# Altium schematic sheet Charger.SchDoc: Chargeur cellules lithium
size Legal; DocumentNumber: 6; SheetNumber: 6; SheetTotal: 8; Version: Gamma 1.0; Conceptor: Philippe Turgeon
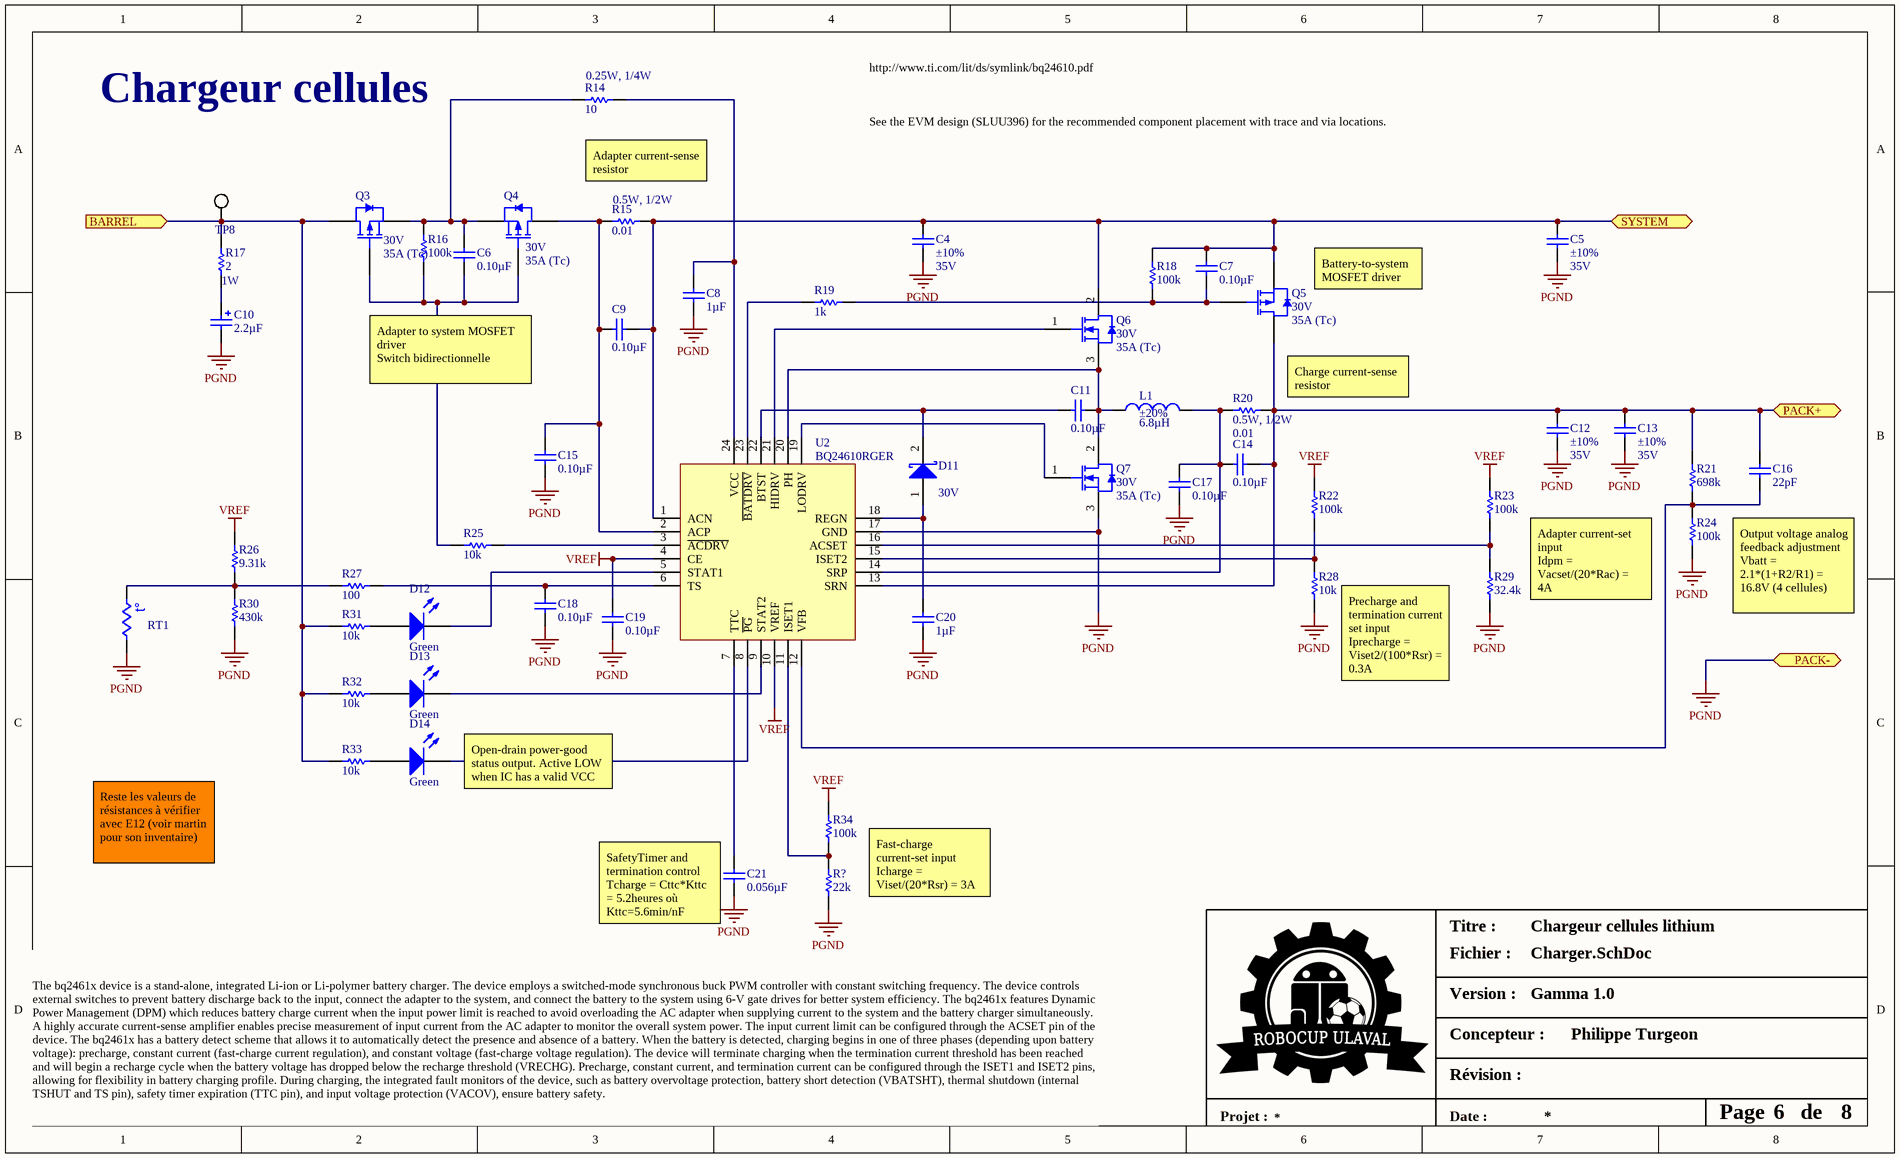
[diagram p0: Charger.SchDoc]

## Parts
C4  Tolerance: ±10%  Voltage - Rated: 35V  [1206]  (hidden comment: GMK316AB7106KL-TR)
C5  Tolerance: ±10%  Voltage - Rated: 35V  [1206]  (hidden comment: GMK316AB7106KL-TR)
C6  Capacitance: 0.10µF  [0603]  (hidden comment: CL10B104KB8SFNC)
C7  Capacitance: 0.10µF  [0603]  (hidden comment: CL10B104KB8SFNC)
C8  Capacitance: 1µF  [0805]  (hidden comment: CL21B105KBFNFNE)
C9  Capacitance: 0.10µF  [0603]  (hidden comment: CL10B104KB8SFNC)
C10  Capacitance: 2.2µF  [CAP 4.3x4.3mm]  (hidden comment: 865060640002)
C11  Capacitance: 0.10µF  [0603]  (hidden comment: CL10B104KB8SFNC)
C12  Tolerance: ±10%  Voltage - Rated: 35V  [1206]  (hidden comment: GMK316AB7106KL-TR)
C13  Tolerance: ±10%  Voltage - Rated: 35V  [1206]  (hidden comment: GMK316AB7106KL-TR)
C14  Capacitance: 0.10µF  [0603]  (hidden comment: CL10B104KB8SFNC)
C15  Capacitance: 0.10µF  [0603]  (hidden comment: CL10B104KB8SFNC)
C16  Capacitance: 22pF  [0603]  (hidden comment: CL10C220GB8NNNC)
C17  Capacitance: 0.10µF  [0603]  (hidden comment: CL10B104KB8SFNC)
C18  Capacitance: 0.10µF  [0603]  (hidden comment: CL10B104KB8SFNC)
C19  Capacitance: 0.10µF  [0603]  (hidden comment: CL10B104KB8SFNC)
C20  Capacitance: 1µF  [0805]  (hidden comment: CL21B105KBFNFNE)
C21  Capacitance: 0.056µF  [0603]  (hidden comment: CL10B563KB8NNNC)
D11  Voltage - DC Reverse (Vr) (Max): 30V  [SOT-23-3]  (hidden comment: BAT54SLT1G)
D12  Color: Green  [0805]  (hidden comment: LG R971-KN-1)
D13  Color: Green  [0805]  (hidden comment: LG R971-KN-1)
D14  Color: Green  [0805]  (hidden comment: LG R971-KN-1)
L1  Inductance: 6.8µH  Tolerance: ±20%  [INDM6965X30N]  (hidden comment: IHLP2525CZER6R8M11)
Q3  Drain to Source Voltage (Vdss): 30V  Current - Continuous Drain (Id) @ 25°C: 35A (Tc)  [PowerPAK 1212-8]  (hidden comment: SI7617DN-T1-GE3)
Q4  Drain to Source Voltage (Vdss): 30V  Current - Continuous Drain (Id) @ 25°C: 35A (Tc)  [PowerPAK 1212-8]  (hidden comment: SI7617DN-T1-GE3)
Q5  Drain to Source Voltage (Vdss): 30V  Current - Continuous Drain (Id) @ 25°C: 35A (Tc)  [PowerPAK 1212-8]  (hidden comment: SI7617DN-T1-GE3)
Q6  Drain to Source Voltage (Vdss): 30V  Current - Continuous Drain (Id) @ 25°C: 35A (Tc)  [PowerPAK 1212-8]  (hidden comment: SI7114ADN-T1-GE3)
Q7  Drain to Source Voltage (Vdss): 30V  Current - Continuous Drain (Id) @ 25°C: 35A (Tc)  [PowerPAK 1212-8]  (hidden comment: SI7114ADN-T1-GE3)
R14  Power (Watts): 0.25W, 1/4W  Resistance (Ohms): 10  (hidden comment: ESR03EZPJ100)
R15  Power (Watts): 0.5W, 1/2W  Resistance (Ohms): 0.01  [1206]  (hidden comment: RU3216FR010CS)
R16  Resistance (Ohms): 100k  [0603]  (hidden comment: RC0603JR-07100KL)
R17  Power (Watts): 1W  Resistance (Ohms): 2  [2512]  (hidden comment: CRCW25122R00JNEG)
R18  Resistance (Ohms): 100k  [0603]  (hidden comment: RC0603JR-07100KL)
R19  Resistance (Ohms): 1k  [0603]  (hidden comment: RC0603JR-071KL)
R20  Power (Watts): 0.5W, 1/2W  Resistance (Ohms): 0.01  [1206]  (hidden comment: RU3216FR010CS)
R21  Resistance (Ohms): 698k  [0603]  (hidden comment: RC0603FR-07698KL)
R22  Resistance (Ohms): 100k  [0603]  (hidden comment: RC0603JR-07100KL)
R23  Resistance (Ohms): 100k  [0603]  (hidden comment: RC0603JR-07100KL)
R24  Resistance (Ohms): 100k  [0603]  (hidden comment: RC0603JR-07100KL)
R25  Resistance (Ohms): 10k  [0603]  (hidden comment: RC0603JR-0710KL)
R26  Resistance (Ohms): 9.31k  [0603]  (hidden comment: RC0603FR-079K31L)
R27  Resistance (Ohms): 100  [0603]  (hidden comment: RC0603FR-07100RL)
R28  Resistance (Ohms): 10k  [0603]  (hidden comment: RC0603JR-0710KL)
R29  Resistance (Ohms): 32.4k  [0603]  (hidden comment: RC0603FR-0732K4L)
R30  Resistance (Ohms): 430k  [0603]  (hidden comment: RC0603FR-07430KL)
R31  Resistance (Ohms): 10k  [0603]  (hidden comment: RC0603JR-0710KL)
R32  Resistance (Ohms): 10k  [0603]  (hidden comment: RC0603JR-0710KL)
R33  Resistance (Ohms): 10k  [0603]  (hidden comment: RC0603JR-0710KL)
R34  Resistance (Ohms): 100k  [0603]  (hidden comment: RC0603JR-07100KL)
R?  Resistance (Ohms): 22k  [0603]  (hidden comment: RC0603FR-0722KL)
RT1  NTCLE100E3103HT1  [NTCLE100E3]  (value not drawn)
TP8  testpoint  [0805 testpoint]  (value not drawn)
U2  BQ24610RGER  [VQFN-24]

## Ports
BARREL (in), PACK+, PACK-, SYSTEM

## Nets
PGND: C4.1 C5.1 C8.1 C10.2 C12.1 C13.1 C15.1 C17.1 C18.1 C19.1 C20.1 C21.1 Q7.3(S) R24.1 R28.1 R29.1 R30.1 R?.1 RT1.2 U2.17(GND) ; port PACK-
VREF: C19.2 R22.2 R23.2 R26.2 R34.2 U2.4(CE) U2.10(VREF)
BARREL: Q3.2(D) R17.2 R31.1 R32.1 R33.1 TP8.1 ; port BARREL
PACK+: C12.2 C13.2 C14.1 C16.2 Q5.2(D) R20.1 R21.2 U2.13(SRN) ; port PACK+
SYSTEM: C4.2 C5.2 C7.2 C9.1 Q5.3(S) Q6.2(D) R15.2 R18.2 U2.1(ACN) ; port SYSTEM
NetC6_1: C6.1 Q3.1(G) Q4.1(G) R16.1 R25.1
NetC6_2: C6.2 Q3.3(S) Q4.3(S) R14.1 R16.2
NetC7_1: C7.1 Q5.1(G) R18.1 R19.2
NetC8_2: C8.2 R14.2 U2.24(VCC)
NetC9_2: C9.2 C15.2 Q4.2(D) R15.1 U2.2(ACP)
NetC10_1: C10.1 R17.1
NetC11_1: C11.1 L1.1 Q6.3(S) Q7.2(D) U2.20(PH)
NetC11_2: C11.2 D11.2(K) U2.22(BTST)
NetC14_2: C14.2 C17.2 L1.2 R20.2 U2.14(SRP)
NetC16_1: C16.1 R21.1 R24.2 U2.12(VFB)
NetC18_2: C18.2 R27.2 U2.6(TS)
NetC20_2: C20.2 D11.1(A) U2.18(REGN)
NetC21_2: C21.2 U2.7(TTC)
NetD12_1: D12.1(A) R31.2
NetD12_2: D12.2(K) U2.5(STAT1)
NetD13_1: D13.1(A) R32.2
NetD13_2: D13.2(K) U2.9(STAT2)
NetD14_1: D14.1(A) R33.2
NetD14_2: D14.2(K) U2.8(~{PG})
NetQ6_1: Q6.1(G) U2.21(HIDRV)
NetQ7_1: Q7.1(G) U2.19(LODRV)
NetR19_1: R19.1 U2.23(~{BATDRV})
NetR22_1: R22.1 R28.2 U2.15(ISET2)
NetR23_1: R23.1 R29.2 U2.16(ACSET)
NetR25_2: R25.2 U2.3(~{ACDRV})
NetR26_1: R26.1 R27.1 R30.2 RT1.1
NetR34_1: R34.1 R?.2 U2.11(ISET1)

## Notes on the sheet
- Chargeur cellules
- Adapter current-sense resistor
- http://www.ti.com/lit/ds/symlink/bq24610.pdf
  See the EVM design (SLUU396) for the recommended component placement with trace and via locations.
- (near Q5) Battery-to-system MOSFET driver
- Adapter to system MOSFET driver
  Switch bidirectionnelle
- Charge current-sense resistor
- Adapter current-set input
  Idpm = Vacset/(20*Rac) = 4A
- Output voltage analog feedback adjustment
  Vbatt = 2.1*(1+R2/R1) = 16.8V (4 cellules)
- Precharge and termination current set input
  Iprecharge = Viset2/(100*Rsr) = 0.3A
- Open-drain power-good status output. Active LOW when IC has a valid VCC
- Reste les valeurs de résistances à vérifier avec E12 (voir martin pour son inventaire)
- Fast-charge current-set input
  Icharge = Viset/(20*Rsr) = 3A
- (near C21) SafetyTimer and termination control
  Tcharge = Cttc*Kttc = 5.2heures où Kttc=5.6min/nF
- Titre :
- Fichier :
- Version :
- Concepteur :
- Révision :
- The bq2461x device is a stand-alone, integrated Li-ion or Li-polymer battery charger. The device employs a switched-mode synchronous buck PWM controller with constant switching frequency. The device controls external switches to prevent battery discharge back to the input, connect the adapter to the system, and connect the battery to the system using 6-V gate drives for better system efficiency. The bq2461x features Dynamic Power Management (DPM) which reduces battery charge current when the input power limit is reached to avoid overloading the AC adapter when supplying current to the system and the battery charger simultaneously. A highly accurate current-sense amplifier enables precise measurement of input current from the AC adapter to monitor the overall system power. The input current limit can be configured through the ACSET pin of the device. The bq2461x has a battery detect scheme that allows it to automatically detect the presence and absence of a battery. When the battery is detected, charging begins in one of three phases (depending upon battery voltage): precharge, constant current (fast-charge current regulation), and constant voltage (fast-charge voltage regulation). The device will terminate charging when the termination current threshold has been reached and will begin a recharge cycle when the battery voltage has dropped below the recharge threshold (VRECHG). Precharge, constant current, and termination current can be configured through the ISET1 and ISET2 pins, allowing for flexibility in battery charging profile. During charging, the integrated fault monitors of the device, such as battery overvoltage protection, battery short detection (VBATSHT), thermal shutdown (internal TSHUT and TS pin), safety timer expiration (TTC pin), and input voltage protection (VACOV), ensure battery safety.
- Projet :
- Date :
- Page
- de
- (in symbol NTCLE100E3103HT1) t°

## Library data of the parts
C4 C5 C12 C13 = GMK316AB7106KL-TR: CAP CER 10UF 35V X7R 1206; Manufacturer: Taiyo Yuden; Capacitance: 10µF; Supplier 1: Digi-Key; Supplier Part Number 1: 587-3007-1-ND; Manufacturer Part Number: GMK316AB7106KL-TR; RoHS: RoHS Compliant; Category: Capacitors; Stock 1: 108706; Pricing 1: 1=0.84, 10=0.697, 50=0.4996, 100=0.4371, 250=0.34344, 500=0.31222, 1000=0.24978 (CAD); Packaging: Cut Tape (CT); Temperature Coefficient: X7R; Mounting Type: Surface Mount, MLCC; Operating Temperature: -55°C ~ 125°C; Applications: General Purpose; Ratings: -; Package / Case: 1206 (3216 Metric); Size / Dimension: 0.126" L x 0.063" W (3.20mm x 1.60mm); Height - Seated (Max): -; Thickness (Max): 0.071" (1.80mm); Lead Spacing: -; Features: -; Lead Style: -; ComponentLink1URL: http://media.digikey.com/pdf/Data%20Sheets/Taiyo%20Yuden%20PDFs%20URL%20links/GMK316AB7106KL-TR_ProdSpec.pdf; ComponentLink1Description: http://media.digikey.com/pdf/Data%20Sheets/Taiyo%20Yuden%20PDFs%20URL%20links/GMK316AB7106KL-TR_ProdSpec.pdf
C6 C7 C9 C11 C14 C15 C17-C19 = CL10B104KB8SFNC: CAP CER 0.1UF 50V X7R 0603; Manufacturer: Samsung Electro-Mechanics America, Inc.; Tolerance: ±10%; Supplier 1: Digi-Key; Manufacturer Part Number: CL10B104KB8SFNC; RoHS: RoHS Compliant; Category: Capacitors; Stock 1: 2612665; Pricing 1: 1=0.14, 10=0.028, 25=0.0204, 50=0.0156, 100=0.0127, 250=0.01064, 500=0.00908, 1000=0.00712 (CAD); Packaging: Cut Tape (CT); Voltage - Rated: 50V; Temperature Coefficient: X7R; Mounting Type: Surface Mount, MLCC; Operating Temperature: -55°C ~ 125°C; Applications: Boardflex Sensitive; Ratings: -; Package / Case: 0603 (1608 Metric); Size / Dimension: 0.063" L x 0.031" W (1.60mm x 0.80mm); Height - Seated (Max): -; Thickness (Max): 0.035" (0.90mm); Lead Spacing: -; Features: Soft Termination; Lead Style: -; ComponentLink1URL: http://www.samsungsem.com/kr/support/product-search/mlcc/CL10B104KB8SFNC.jsp; ComponentLink1Description: http://www.samsungsem.com/kr/support/product-search/mlcc/CL10B104KB8SFNC.jsp; Supplier Part Number 1: 1276-1936-1-ND
C8 C20 = CL21B105KBFNFNE: CAP CER 1UF 50V X7R 0805; Manufacturer: Samsung Electro-Mechanics America, Inc.; Tolerance: ±10%; Supplier 1: Digi-Key; Manufacturer Part Number: CL21B105KBFNFNE; RoHS: RoHS Compliant; Stock 1: 21699; Pricing 1: 1=0.27, 10=0.186, 25=0.14, 50=0.1072, 100=0.0884, 500=0.06238, 1000=0.05123 (CAD); Packaging: Cut Tape (CT); Voltage - Rated: 50V; Temperature Coefficient: X7R; Mounting Type: Surface Mount, MLCC; Operating Temperature: -55°C ~ 125°C; Applications: General Purpose; Ratings: -; Package / Case: 0805 (2012 Metric); Size / Dimension: 0.079" L x 0.049" W (2.00mm x 1.25mm); Height - Seated (Max): -; Thickness (Max): 0.053" (1.35mm); Lead Spacing: -; Features: -; Lead Style: -; ComponentLink1URL: http://www.samsungsem.com/kr/support/product-search/mlcc/CL21B105KBFNFNE.jsp; ComponentLink1Description: http://www.samsungsem.com/kr/support/product-search/mlcc/CL21B105KBFNFNE.jsp; Supplier Part Number 1: 1276-2928-1-ND; Category: Capacitors
C10 = 865060640002: CAP 2.2 UF 20% 50 V; Manufacturer: Wurth Electronics Inc; Voltage Rating: 50V; Lifetime @ Temp.: 2000 Hrs @ 105°C; Polarization: Polar; Ripple Current: 60mA @ 100kHz; Impedance: 2.9 Ohm; Surface Mount Land Size: 0.169" L x 0.169" W (4.30mm x 4.30mm); Supplier 1: Digi-Key; Manufacturer Part Number: 865060640002; RoHS: RoHS Compliant; Category: Capacitors; Stock 1: 1681; Pricing 1: 1=0.26, 50=0.217, 100=0.1888, 250=0.16788, 500=0.1469, 1000=0.1399 (CAD); Packaging: Cut Tape (CT); Tolerance: ±20%; ESR (Equivalent Series Resistance): -; Operating Temperature: -55°C ~ 105°C; Applications: General Purpose; Lead Spacing: -; Size / Dimension: 0.157" Dia (4.00mm); Height - Seated (Max): 0.217" (5.50mm); Mounting Type: Surface Mount; Package / Case: Radial, Can - SMD; ComponentLink1URL: http://katalog.we-online.de/pbs/datasheet/865060640002.pdf; ComponentLink1Description: http://katalog.we-online.de/pbs/datasheet/865060640002.pdf; Supplier Part Number 1: 732-8542-1-ND
C16 = CL10C220GB8NNNC: CAP CER 22PF 50V NP0 0603; Manufacturer: Samsung Electro-Mechanics America, Inc.; Tolerance: ±2%; Temperature Coefficient: C0G, NP0; Supplier 1: Digi-Key; Manufacturer Part Number: CL10C220GB8NNNC; RoHS: RoHS Compliant; Category: Capacitors; Stock 1: 20000; Pricing 1: 1=0.18, 10=0.128, 25=0.096, 50=0.0736, 100=0.0609, 500=0.04288, 1000=0.03519 (CAD); Packaging: Cut Tape (CT); Voltage - Rated: 50V; Mounting Type: Surface Mount, MLCC; Operating Temperature: -55°C ~ 125°C; Applications: General Purpose; Ratings: -; Package / Case: 0603 (1608 Metric); Size / Dimension: 0.063" L x 0.031" W (1.60mm x 0.80mm); Height - Seated (Max): -; Thickness (Max): 0.035" (0.90mm); Lead Spacing: -; Features: -; Lead Style: -; ComponentLink1URL: http://www.samsungsem.com/kr/support/product-search/mlcc/CL10C220GB8NNNC.jsp; ComponentLink1Description: http://www.samsungsem.com/kr/support/product-search/mlcc/CL10C220GB8NNNC.jsp; Supplier Part Number 1: 1276-2225-1-ND
C21 = CL10B563KB8NNNC: CAP CER 0.056UF 50V X7R 0603; Manufacturer: Samsung Electro-Mechanics America, Inc.; Tolerance: ±10%; Supplier 1: Digi-Key; Manufacturer Part Number: CL10B563KB8NNNC; RoHS: RoHS Compliant; Category: Capacitors; Stock 1: 2188; Pricing 1: 1=0.16, 10=0.109, 25=0.0824, 50=0.0634, 100=0.0523, 500=0.03686, 1000=0.03027 (CAD); Packaging: Cut Tape (CT); Voltage - Rated: 50V; Temperature Coefficient: X7R; Mounting Type: Surface Mount, MLCC; Operating Temperature: -55°C ~ 125°C; Applications: General Purpose; Ratings: -; Package / Case: 0603 (1608 Metric); Size / Dimension: 0.063" L x 0.031" W (1.60mm x 0.80mm); Height - Seated (Max): -; Thickness (Max): 0.035" (0.90mm); Lead Spacing: -; Features: -; Lead Style: -; ComponentLink1URL: http://www.samsungsem.com/kr/support/product-search/mlcc/CL10B563KB8NNNC.jsp; ComponentLink1Description: http://www.samsungsem.com/kr/support/product-search/mlcc/CL10B563KB8NNNC.jsp; Supplier Part Number 1: 1276-2096-1-ND
D11 = BAT54SLT1G: DIODE ARRAY SCHOTTKY 30V SOT23-3; Manufacturer: ON Semiconductor; Diode Configuration: 1 Pair Series Connection; Current - Average Rectified (Io) (per Diode): 200mA (DC); Voltage - Forward (Vf) (Max) @ If: 800mV @ 100mA; Speed: Small Signal =< 200mA (Io), Any Speed; Reverse Recovery Time (trr): 5ns; Current - Reverse Leakage @ Vr: 2µA @ 25V; Supplier 1: Digi-Key; Supplier Part Number 1: BAT54SLT1GOSCT-ND; Manufacturer Part Number: BAT54SLT1G; RoHS: RoHS Compliant; Category: Discrete Semiconductor Products; Stock 1: 85691; Pricing 1: 1=0.24, 10=0.225, 100=0.1226, 500=0.07536, 1000=0.0514 (CAD); Packaging: Cut Tape (CT); Diode Type: Schottky; Mounting Type: Surface Mount; Package / Case: TO-236-3, SC-59, SOT-23-3; Supplier Device Package: SOT-23-3 (TO-236); ComponentLink1URL: http://www.onsemi.com/pub_link/Collateral/BAT54SLT1-D.PDF; ComponentLink1Description: http://www.onsemi.com/pub_link/Collateral/BAT54SLT1-D.PDF
D12-D14 = LG R971-KN-1: LED GREEN DIFFUSED 0805 SMD; Manufacturer: OSRAM Opto Semiconductors Inc.; Lens Color: White; Millicandela Rating: 26.05mcd; Lens Style/Size: Rectangle with Flat Top, 1.30mm x 1.25mm; Voltage - Forward (Vf) (Typ): 2.2V; Current - Test: 20mA; Viewing Angle: 160°; Wavelength - Dominant: 570nm; Wavelength - Peak: 572nm; Supplier 1: Digi-Key; Supplier Part Number 1: 475-1410-1-ND; Manufacturer Part Number: LG R971-KN-1; RoHS: RoHS Compliant; Category: Optoelectronics; Stock 1: 315869; Pricing 1: 1=0.37, 10=0.267, 25=0.1972, 100=0.141, 250=0.09588, 500=0.0846, 1000=0.06626 (CAD); Packaging: Cut Tape (CT); Lens Transparency: Diffused; Mounting Type: Surface Mount; Features: -; Package / Case: 0805 (2012 Metric); Supplier Device Package: *; Size / Dimension: 2.00mm L x 1.25mm W; Height (Max): 0.90mm; ComponentLink1URL: http://www.osram-os.com/Graphics/XPic9/00078860_0.pdf; ComponentLink1Description: http://www.osram-os.com/Graphics/XPic9/00078860_0.pdf
L1 = IHLP2525CZER6R8M11: FIXED IND 6.8UH 5.5A 46.8 MOHM; Manufacturer: Vishay Dale; Type: Molded; Material - Core: Powdered Iron; Current - Saturation: 4A; Shielding: Shielded; DC Resistance (DCR): 46.8 mOhm Max; Frequency - Test: 100kHz; Supplier 1: Digi-Key; Supplier Part Number 1: 541-2582-1-ND; Manufacturer Part Number: IHLP2525CZER6R8M11; RoHS: RoHS Compliant; Category: Inductors, Coils, Chokes; Stock 1: 3980; Pricing 1: 1=2.79, 10=2.612, 25=2.4376, 50=2.0894, 100=1.9849, 250=1.8108, 500=1.60186, 1000=1.46256 (CAD); Packaging: Cut Tape (CT); Current Rating: 5.5A; Q @ Freq: -; Frequency - Self Resonant: -; Ratings: -; Operating Temperature: -55°C ~ 125°C; Mounting Type: Surface Mount; Package / Case: Nonstandard; Size / Dimension: 0.270" L x 0.255" W (6.86mm x 6.47mm); Height - Seated (Max): 0.118" (3.00mm); ComponentLink1URL: http://www.vishay.com/docs/34190/ihlp25cz.pdf; ComponentLink1Description: http://www.vishay.com/docs/34190/ihlp25cz.pdf
Q3-Q5 = SI7617DN-T1-GE3: MOSFET P-CH 30V 35A 1212-8 PPAK; Manufacturer: Vishay Siliconix; FET Type: MOSFET P-Channel, Metal Oxide; FET Feature: Standard; Rds On (Max) @ Id, Vgs: 12.3 mOhm @ 13.9A, 10V; Vgs(th) (Max) @ Id: 2.5V @ 250µA; Gate Charge (Qg) @ Vgs: 59nC @ 10V; Input Capacitance (Ciss) @ Vds: 1800pF @ 15V; Power - Max: 52W; Supplier 1: Digi-Key; Supplier Part Number 1: SI7617DN-T1-GE3CT-ND; Manufacturer Part Number: SI7617DN-T1-GE3; RoHS: RoHS Compliant; Category: Discrete Semiconductor Products; Stock 1: 39013; Pricing 1: 1=1.24, 10=1.102, 25=1.046, 100=0.8589, 250=0.80288, 500=0.70954, 1000=0.56016 (CAD); Packaging: Cut Tape (CT); Operating Temperature: -55°C ~ 150°C (TJ); Mounting Type: Surface Mount; Package / Case: PowerPAK® 1212-8; Supplier Device Package: PowerPAK® 1212-8; ComponentLink1URL: http://www.vishay.com/docs/65164/si7617dn.pdf; ComponentLink1Description: http://www.vishay.com/docs/65164/si7617dn.pdf
Q6 Q7 = SI7114ADN-T1-GE3: MOSFET N-CH 30V 35A PPAK 1212-8; Manufacturer: Vishay Siliconix; FET Type: MOSFET N-Channel, Metal Oxide; FET Feature: Standard; Rds On (Max) @ Id, Vgs: 7.5 mOhm @ 18A, 10V; Vgs(th) (Max) @ Id: 2.5V @ 250µA; Gate Charge (Qg) @ Vgs: 32nC @ 10V; Input Capacitance (Ciss) @ Vds: 1230pF @ 15V; Power - Max: 39W; Supplier 1: Digi-Key; Supplier Part Number 1: SI7114ADN-T1-GE3CT-ND; Manufacturer Part Number: SI7114ADN-T1-GE3; RoHS: RoHS Compliant; Category: Discrete Semiconductor Products; Stock 1: 3921; Pricing 1: 1=1.32, 10=1.16, 25=1.0896, 100=0.8892, 250=0.82596, 500=0.70294, 1000=0.56235 (CAD); Packaging: Cut Tape (CT); Operating Temperature: -55°C ~ 150°C (TJ); Mounting Type: Surface Mount; Package / Case: PowerPAK® 1212-8; Supplier Device Package: PowerPAK® 1212-8; ComponentLink1URL: http://www.vishay.com/docs/68932/si7114ad.pdf; ComponentLink1Description: http://www.vishay.com/docs/68932/si7114ad.pdf
R14 = ESR03EZPJ100: RES SMD 10 OHM 5% 1/4W 0603; Manufacturer: Rohm Semiconductor; Temperature Coefficient: ±200ppm/°C; Supplier 1: Digi-Key; Manufacturer Part Number: ESR03EZPJ100; RoHS: RoHS Compliant; Category: Resistors; Stock 1: 39971; Pricing 1: 1=0.15, 10=0.12, 25=0.0824, 100=0.0459, 250=0.03572, 500=0.0284, 1000=0.02015 (CAD); Packaging: Cut Tape (CT); Tolerance: ±5%; Composition: Thick Film; Features: Automotive AEC-Q200, Pulse Withstanding; Operating Temperature: -55°C ~ 155°C; Package / Case: 0603 (1608 Metric); Supplier Device Package: 0603; Size / Dimension: 0.063" L x 0.031" W (1.60mm x 0.80mm); Height: 0.022" (0.55mm); Number of Terminations: 2; ComponentLink1URL: http://rohmfs.rohm.com/en/products/databook/datasheet/passive/resistor/chip_resistor/esr.pdf; ComponentLink1Description: http://rohmfs.rohm.com/en/products/databook/datasheet/passive/resistor/chip_resistor/esr.pdf; Supplier Part Number 1: RHM10DCT-ND
R15 R20 = RU3216FR010CS: RES SMD 0.01 OHM 1% 1/2W 1206; Manufacturer: Samsung Electro-Mechanics America, Inc.; Temperature Coefficient: ±500ppm/°C; Supplier 1: Digi-Key; Manufacturer Part Number: RU3216FR010CS; RoHS: RoHS Compliant; Category: Resistors; Stock 1: 43048; Pricing 1: 1=0.65, 10=0.494, 25=0.376, 50=0.2792, 100=0.2077, 500=0.1504, 1000=0.11458 (CAD); Packaging: Cut Tape (CT); Tolerance: ±1%; Composition: Thick Film; Features: Current Sense, Moisture Resistant; Operating Temperature: -55°C ~ 155°C; Package / Case: 1206 (3216 Metric); Supplier Device Package: 1206; Size / Dimension: 0.126" L x 0.063" W (3.20mm x 1.60mm); Height: 0.028" (0.70mm); Number of Terminations: 2; ComponentLink1URL: http://media.digikey.com/pdf/Data%20Sheets/Samsung%20PDFs/RU_Series_ds.pdf; ComponentLink1Description: http://media.digikey.com/pdf/Data%20Sheets/Samsung%20PDFs/RU_Series_ds.pdf; Supplier Part Number 1: 1276-6160-1-ND
R16 R18 R22-R24 R34 = RC0603JR-07100KL: RES SMD 100K OHM 5% 1/10W 0603; Manufacturer: Yageo; Power (Watts): 0.1W, 1/10W; Temperature Coefficient: ±100ppm/°C; Supplier 1: Digi-Key; Manufacturer Part Number: RC0603JR-07100KL; RoHS: RoHS Compliant; Category: Resistors; Stock 1: 2803334; Pricing 1: 1=0.15, 10=0.017, 25=0.012, 100=0.0067, 250=0.00508, 500=0.00408, 1000=0.003, 2500=0.0026 (CAD); Packaging: Cut Tape (CT); Tolerance: ±5%; Composition: Thick Film; Features: Moisture Resistant; Operating Temperature: -55°C ~ 155°C; Package / Case: 0603 (1608 Metric); Supplier Device Package: 0603; Size / Dimension: 0.063" L x 0.031" W (1.60mm x 0.80mm); Height: 0.022" (0.55mm); Number of Terminations: 2; ComponentLink1URL: http://www.yageo.com/documents/recent/PYu-RC_Group_51_RoHS_L_04.pdf; ComponentLink1Description: http://www.yageo.com/documents/recent/PYu-RC_Group_51_RoHS_L_04.pdf; Supplier Part Number 1: 311-100KGRCT-ND
R17 = CRCW25122R00JNEG: RES SMD 2 OHM 5% 1W 2512; Manufacturer: Vishay Dale; Temperature Coefficient: ±200ppm/°C; Supplier 1: Digi-Key; Manufacturer Part Number: CRCW25122R00JNEG; RoHS: RoHS Compliant; Category: Resistors; Stock 1: 37929; Pricing 1: 1=0.55, 10=0.459, 25=0.3332, 50=0.2416, 100=0.1791, 250=0.1374, 500=0.10826, 1000=0.07494 (CAD); Packaging: Cut Tape (CT); Tolerance: ±5%; Composition: Thick Film; Features: Automotive AEC-Q200; Operating Temperature: -55°C ~ 155°C; Package / Case: 2512 (6432 Metric); Supplier Device Package: 2512; Size / Dimension: 0.248" L x 0.124" W (6.30mm x 3.15mm); Height: 0.028" (0.70mm); Number of Terminations: 2; ComponentLink1URL: http://www.vishay.com/docs/20035/dcrcwe3.pdf; ComponentLink1Description: http://www.vishay.com/docs/20035/dcrcwe3.pdf; Supplier Part Number 1: 541-2.0XCT-ND
R19 = RC0603JR-071KL: RES SMD 1K OHM 5% 1/10W 0603; Manufacturer: Yageo; Power (Watts): 0.1W, 1/10W; Temperature Coefficient: ±100ppm/°C; Supplier 1: Digi-Key; Manufacturer Part Number: RC0603JR-071KL; RoHS: RoHS Compliant; Category: Resistors; Stock 1: 1078221; Pricing 1: 1=0.15, 10=0.017, 25=0.012, 100=0.0067, 250=0.00508, 500=0.00408, 1000=0.003, 2500=0.0026 (CAD); Packaging: Cut Tape (CT); Tolerance: ±5%; Composition: Thick Film; Features: Moisture Resistant; Operating Temperature: -55°C ~ 155°C; Package / Case: 0603 (1608 Metric); Supplier Device Package: 0603; Size / Dimension: 0.063" L x 0.031" W (1.60mm x 0.80mm); Height: 0.022" (0.55mm); Number of Terminations: 2; ComponentLink1URL: http://www.yageo.com/documents/recent/PYu-RC_Group_51_RoHS_L_04.pdf; ComponentLink1Description: http://www.yageo.com/documents/recent/PYu-RC_Group_51_RoHS_L_04.pdf; Supplier Part Number 1: 311-1.0KGRCT-ND
R21 = RC0603FR-07698KL: RES SMD 698K OHM 1% 1/10W 0603; Manufacturer: Yageo; Power (Watts): 0.1W, 1/10W; Temperature Coefficient: ±100ppm/°C; Supplier 1: Digi-Key; Manufacturer Part Number: RC0603FR-07698KL; RoHS: RoHS Compliant; Category: Resistors; Stock 1: 48553; Pricing 1: 1=0.15, 10=0.021, 25=0.0152, 100=0.0086, 250=0.0066, 500=0.00526, 1000=0.00389, 2500=0.00337 (CAD); Packaging: Cut Tape (CT); Tolerance: ±1%; Composition: Thick Film; Features: Moisture Resistant; Operating Temperature: -55°C ~ 155°C; Package / Case: 0603 (1608 Metric); Supplier Device Package: 0603; Size / Dimension: 0.063" L x 0.031" W (1.60mm x 0.80mm); Height: 0.022" (0.55mm); Number of Terminations: 2; ComponentLink1URL: http://www.yageo.com/documents/recent/PYu-RC_Group_51_RoHS_L_04.pdf; ComponentLink1Description: http://www.yageo.com/documents/recent/PYu-RC_Group_51_RoHS_L_04.pdf; Supplier Part Number 1: 311-698KHRCT-ND
R25 R28 R31-R33 = RC0603JR-0710KL: RES SMD 10K OHM 5% 1/10W 0603; Manufacturer: Yageo; Power (Watts): 0.1W, 1/10W; Temperature Coefficient: ±100ppm/°C; Supplier 1: Digi-Key; Manufacturer Part Number: RC0603JR-0710KL; RoHS: RoHS Compliant; Category: Resistors; Stock 1: 5547866; Pricing 1: 1=0.15, 10=0.017, 25=0.012, 100=0.0067, 250=0.00508, 500=0.00408, 1000=0.003, 2500=0.0026 (CAD); Packaging: Cut Tape (CT); Tolerance: ±5%; Composition: Thick Film; Features: Moisture Resistant; Operating Temperature: -55°C ~ 155°C; Package / Case: 0603 (1608 Metric); Supplier Device Package: 0603; Size / Dimension: 0.063" L x 0.031" W (1.60mm x 0.80mm); Height: 0.022" (0.55mm); Number of Terminations: 2; ComponentLink1URL: http://www.yageo.com/documents/recent/PYu-RC_Group_51_RoHS_L_04.pdf; ComponentLink1Description: http://www.yageo.com/documents/recent/PYu-RC_Group_51_RoHS_L_04.pdf; Supplier Part Number 1: 311-10KGRCT-ND
R26 = RC0603FR-079K31L: RES SMD 9.31K OHM 1% 1/10W 0603; Manufacturer: Yageo; Power (Watts): 0.1W, 1/10W; Temperature Coefficient: ±100ppm/°C; Supplier 1: Digi-Key; Manufacturer Part Number: RC0603FR-079K31L; RoHS: RoHS Compliant; Category: Resistors; Stock 1: 132733; Pricing 1: 1=0.15, 10=0.021, 25=0.0152, 100=0.0086, 250=0.0066, 500=0.00526, 1000=0.00389, 2500=0.00337 (CAD); Packaging: Cut Tape (CT); Tolerance: ±1%; Composition: Thick Film; Features: Moisture Resistant; Operating Temperature: -55°C ~ 155°C; Package / Case: 0603 (1608 Metric); Supplier Device Package: 0603; Size / Dimension: 0.063" L x 0.031" W (1.60mm x 0.80mm); Height: 0.022" (0.55mm); Number of Terminations: 2; ComponentLink1URL: http://www.yageo.com/documents/recent/PYu-RC_Group_51_RoHS_L_04.pdf; ComponentLink1Description: http://www.yageo.com/documents/recent/PYu-RC_Group_51_RoHS_L_04.pdf; Supplier Part Number 1: 311-9.31KHRCT-ND
R27 = RC0603FR-07100RL: RES SMD 100 OHM 1% 1/10W 0603; Manufacturer: Yageo; Power (Watts): 0.1W, 1/10W; Temperature Coefficient: ±100ppm/°C; Supplier 1: Digi-Key; Manufacturer Part Number: RC0603FR-07100RL; RoHS: RoHS Compliant; Category: Resistors; Stock 1: 2558990; Pricing 1: 1=0.15, 10=0.021, 25=0.0152, 100=0.0086, 250=0.0066, 500=0.00526, 1000=0.00389, 2500=0.00337 (CAD); Packaging: Cut Tape (CT); Tolerance: ±1%; Composition: Thick Film; Features: Moisture Resistant; Operating Temperature: -55°C ~ 155°C; Package / Case: 0603 (1608 Metric); Supplier Device Package: 0603; Size / Dimension: 0.063" L x 0.031" W (1.60mm x 0.80mm); Height: 0.022" (0.55mm); Number of Terminations: 2; ComponentLink1URL: http://www.yageo.com/documents/recent/PYu-RC_Group_51_RoHS_L_04.pdf; ComponentLink1Description: http://www.yageo.com/documents/recent/PYu-RC_Group_51_RoHS_L_04.pdf; Supplier Part Number 1: 311-100HRCT-ND
R29 = RC0603FR-0732K4L: RES SMD 32.4K OHM 1% 1/10W 0603; Manufacturer: Yageo; Power (Watts): 0.1W, 1/10W; Temperature Coefficient: ±100ppm/°C; Supplier 1: Digi-Key; Manufacturer Part Number: RC0603FR-0732K4L; RoHS: RoHS Compliant; Category: Resistors; Stock 1: 76412; Pricing 1: 1=0.15, 10=0.021, 25=0.0152, 100=0.0086, 250=0.0066, 500=0.00526, 1000=0.00389, 2500=0.00337 (CAD); Packaging: Cut Tape (CT); Tolerance: ±1%; Composition: Thick Film; Features: Moisture Resistant; Operating Temperature: -55°C ~ 155°C; Package / Case: 0603 (1608 Metric); Supplier Device Package: 0603; Size / Dimension: 0.063" L x 0.031" W (1.60mm x 0.80mm); Height: 0.022" (0.55mm); Number of Terminations: 2; ComponentLink1URL: http://www.yageo.com/documents/recent/PYu-RC_Group_51_RoHS_L_04.pdf; ComponentLink1Description: http://www.yageo.com/documents/recent/PYu-RC_Group_51_RoHS_L_04.pdf; Supplier Part Number 1: 311-32.4KHRCT-ND
R30 = RC0603FR-07430KL: RES SMD 430K OHM 1% 1/10W 0603; Manufacturer: Yageo; Power (Watts): 0.1W, 1/10W; Temperature Coefficient: ±100ppm/°C; Supplier 1: Digi-Key; Manufacturer Part Number: RC0603FR-07430KL; RoHS: RoHS Compliant; Category: Resistors; Stock 1: 92906; Pricing 1: 1=0.15, 10=0.021, 25=0.0152, 100=0.0086, 250=0.0066, 500=0.00526, 1000=0.00389, 2500=0.00337 (CAD); Packaging: Cut Tape (CT); Tolerance: ±1%; Composition: Thick Film; Features: Moisture Resistant; Operating Temperature: -55°C ~ 155°C; Package / Case: 0603 (1608 Metric); Supplier Device Package: 0603; Size / Dimension: 0.063" L x 0.031" W (1.60mm x 0.80mm); Height: 0.022" (0.55mm); Number of Terminations: 2; ComponentLink1URL: http://www.yageo.com/documents/recent/PYu-RC_Group_51_RoHS_L_04.pdf; ComponentLink1Description: http://www.yageo.com/documents/recent/PYu-RC_Group_51_RoHS_L_04.pdf; Supplier Part Number 1: 311-430KHRCT-ND
R? = RC0603FR-0722KL: RES SMD 22K OHM 1% 1/10W 0603; Manufacturer: Yageo; Power (Watts): 0.1W, 1/10W; Temperature Coefficient: ±100ppm/°C; Supplier 1: Digi-Key; Manufacturer Part Number: RC0603FR-0722KL; RoHS: RoHS Compliant; Category: Resistors; Stock 1: 2610640; Pricing 1: 1=0.15, 10=0.021, 25=0.0152, 100=0.0086, 250=0.0066, 500=0.00526, 1000=0.00389, 2500=0.00337 (CAD); Packaging: Cut Tape (CT); Tolerance: ±1%; Composition: Thick Film; Features: Moisture Resistant; Operating Temperature: -55°C ~ 155°C; Package / Case: 0603 (1608 Metric); Supplier Device Package: 0603; Size / Dimension: 0.063" L x 0.031" W (1.60mm x 0.80mm); Height: 0.022" (0.55mm); Number of Terminations: 2; ComponentLink1URL: http://www.yageo.com/documents/recent/PYu-RC_Group_51_RoHS_L_04.pdf; ComponentLink1Description: http://www.yageo.com/documents/recent/PYu-RC_Group_51_RoHS_L_04.pdf; Supplier Part Number 1: 311-22.0KHRCT-ND
RT1 = NTCLE100E3103HT1: THERMISTOR NTC 10K 3% RADIAL; Manufacturer: Vishay BC Components; B Value Tolerance: ±0.75%; B25/85: 3977K; Power - Max: 500mW; Supplier 1: Digi-Key; Supplier Part Number 1: BC2395CT-ND; Manufacturer Part Number: NTCLE100E3103HT1; RoHS: RoHS Compliant; Category: Sensors, Transducers; Stock 1: 32497; Pricing 1: 1=0.68, 10=0.465, 50=0.4382, 100=0.3903, 250=0.38336, 500=0.36284 (CAD); Packaging: Cut Tape (CT); Resistance in Ohms @ 25°C: 10k; Resistance Tolerance: ±3%; B0/50: -; B25/50: -; B25/75: -; B25/100: -; Operating Temperature: -40°C ~ 125°C; Length - Lead Wire: 0.59" (15.00mm); Mounting Type: Through Hole; Package / Case: Bead; ComponentLink1URL: http://www.vishay.com/docs/29049/ntcle100.pdf; ComponentLink1Description: http://www.vishay.com/docs/29049/ntcle100.pdf
U2 = BQ24610RGER: IC SYNC SW-MODE BAT CHRGR 24VQFN; Manufacturer: Texas Instruments; Battery Chemistry: Lithium-Ion/Polymer; Number of Cells: 1 ~ 6; Current - Charging: Constant - Programmable; Programmable Features: Current; Fault Protection: Over Current, Over Temperature, Over Voltage, Short Circuit; Charge Current - Max: 10A; Battery Pack Voltage: 2.1V; Voltage - Supply (Max): 28V; Supplier 1: Digi-Key; Supplier Part Number 1: 296-29437-1-ND; Manufacturer Part Number: BQ24610RGER; RoHS: RoHS Compliant; Category: Integrated Circuits (ICs); Stock 1: 4923; Pricing 1: 1=9.61, 10=8.622, 100=7.0732, 500=6.01742, 1000=4.39869 (CAD); Packaging: Cut Tape (CT); Interface: -; Operating Temperature: 0°C ~ 125°C (TJ); Package / Case: 24-VFQFN Exposed Pad; Supplier Device Package: 24-VQFN (4x4); ComponentLink1URL: http://www.ti.com/lit/ds/symlink/bq24610.pdf; ComponentLink1Description: http://www.ti.com/lit/ds/symlink/bq24610.pdf